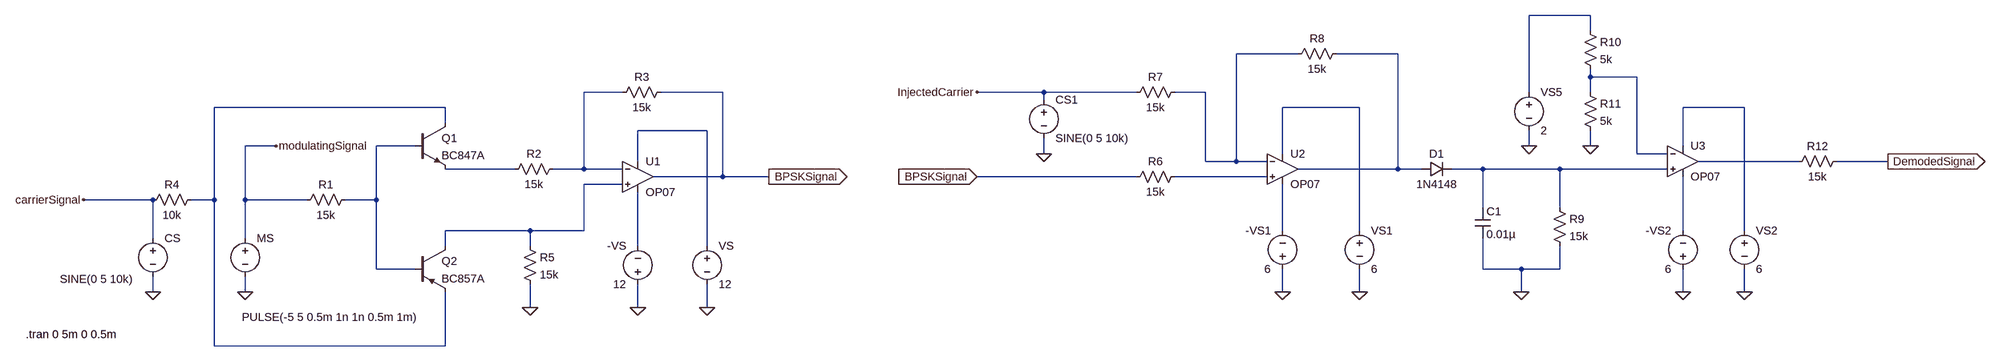
[diagram p0: schematic modulador_demoduladorBPSK_final.asc]
modulador_demoduladorBPSK_final.asc, the LTspice schematic file:
Version 4.1
SHEET 1 3504 680
WIRE 2624 -352 2496 -352
WIRE 2624 -320 2624 -352
WIRE 2016 -272 1888 -272
WIRE 2224 -272 2096 -272
WIRE 2624 -224 2624 -240
WIRE 2720 -224 2624 -224
WIRE 432 -192 352 -192
WIRE 640 -192 512 -192
WIRE 1488 -192 1344 -192
WIRE 1680 -192 1488 -192
WIRE 1824 -192 1760 -192
WIRE 2496 -192 2496 -352
WIRE 2624 -192 2624 -224
WIRE 1488 -176 1488 -192
WIRE 64 -160 -416 -160
WIRE 2144 -160 1984 -160
WIRE 2944 -160 2816 -160
WIRE 64 -128 64 -160
WIRE 608 -112 464 -112
WIRE -288 -80 -352 -80
WIRE 0 -80 -80 -80
WIRE 2496 -80 2496 -112
WIRE 2624 -80 2624 -112
WIRE 2816 -80 2816 -160
WIRE 1488 -64 1488 -96
WIRE 1984 -64 1984 -160
WIRE 2720 -64 2720 -224
WIRE 2784 -64 2720 -64
WIRE 464 -48 464 -112
WIRE 1824 -48 1824 -192
WIRE 1888 -48 1888 -272
WIRE 1888 -48 1824 -48
WIRE 1952 -48 1888 -48
WIRE 3056 -48 2848 -48
WIRE 3264 -48 3136 -48
WIRE 208 -32 64 -32
WIRE 352 -32 352 -192
WIRE 352 -32 288 -32
WIRE 432 -32 352 -32
WIRE 2224 -32 2224 -272
WIRE 2224 -32 2016 -32
WIRE 2272 -32 2224 -32
WIRE 2400 -32 2336 -32
WIRE 2560 -32 2400 -32
WIRE 2784 -32 2560 -32
WIRE 640 -16 640 -192
WIRE 640 -16 496 -16
WIRE 736 -16 640 -16
WIRE 1680 -16 1344 -16
WIRE 1952 -16 1760 -16
WIRE 432 0 352 0
WIRE -544 32 -688 32
WIRE -416 32 -416 -160
WIRE -416 32 -464 32
WIRE -352 32 -352 -80
WIRE -224 32 -352 32
WIRE -80 32 -80 -80
WIRE -80 32 -144 32
WIRE 2400 48 2400 -32
WIRE 2560 48 2560 -32
WIRE 240 96 64 96
WIRE 352 96 352 0
WIRE 352 96 240 96
WIRE 1984 96 1984 0
WIRE 2144 96 2144 -160
WIRE 2816 96 2816 -16
WIRE 2944 96 2944 -160
WIRE -544 112 -544 32
WIRE -352 112 -352 32
WIRE 64 128 64 96
WIRE 240 128 240 96
WIRE 464 128 464 16
WIRE 608 128 608 -112
WIRE -80 176 -80 32
WIRE 0 176 -80 176
WIRE 2400 176 2400 112
WIRE 2480 176 2400 176
WIRE 2560 176 2560 128
WIRE 2560 176 2480 176
WIRE -544 224 -544 192
WIRE -352 224 -352 192
WIRE 1984 224 1984 176
WIRE 2144 224 2144 176
WIRE 2480 224 2480 176
WIRE 2816 224 2816 176
WIRE 2944 224 2944 176
WIRE 240 256 240 208
WIRE 464 256 464 208
WIRE 608 256 608 208
WIRE -416 336 -416 32
WIRE 64 336 64 224
WIRE 64 336 -416 336
FLAG -352 224 0
FLAG 240 256 0
FLAG 464 256 0
FLAG 608 256 0
FLAG 736 -16 BPSKSignal
IOPIN 736 -16 Out
FLAG -544 224 0
FLAG -288 -80 modulatingSignal
FLAG -688 32 carrierSignal
FLAG 1344 -16 BPSKSignal
IOPIN 1344 -16 In
FLAG 1488 -64 0
FLAG 1984 224 0
FLAG 2144 224 0
FLAG 2480 224 0
FLAG 2496 -80 0
FLAG 2624 -80 0
FLAG 2816 224 0
FLAG 2944 224 0
FLAG 3264 -48 DemodedSignal
IOPIN 3264 -48 Out
FLAG 1344 -192 InjectedCarrier
SYMBOL voltage -352 96 R0
WINDOW 3 -7 180 Left 2
WINDOW 123 0 0 Left 0
WINDOW 39 0 0 Left 0
SYMATTR Value PULSE(-5 5 0.5m 1n 1n 0.5m 1m)
SYMATTR InstName MS
SYMBOL voltage -544 96 R0
WINDOW 3 -193 101 Left 2
WINDOW 123 0 0 Left 0
WINDOW 39 0 0 Left 0
SYMATTR Value SINE(0 5 10k)
SYMATTR InstName CS
SYMBOL voltage 608 112 R0
WINDOW 123 0 0 Left 0
WINDOW 39 0 0 Left 0
SYMATTR InstName VS
SYMATTR Value 12
SYMBOL res -128 16 R90
WINDOW 0 0 56 VBottom 2
WINDOW 3 32 56 VTop 2
SYMATTR InstName R1
SYMATTR Value 15k
SYMBOL res 304 -48 R90
WINDOW 0 0 56 VBottom 2
WINDOW 3 32 56 VTop 2
SYMATTR InstName R2
SYMATTR Value 15k
SYMBOL res 528 -208 R90
WINDOW 0 0 56 VBottom 2
WINDOW 3 32 56 VTop 2
SYMATTR InstName R3
SYMATTR Value 15k
SYMBOL res -560 48 R270
WINDOW 0 32 56 VTop 2
WINDOW 3 0 56 VBottom 2
SYMATTR InstName R4
SYMATTR Value 10k
SYMBOL res 224 112 R0
SYMATTR InstName R5
SYMATTR Value 15k
SYMBOL npn 0 -128 R0
SYMATTR InstName Q1
SYMATTR Value BC847A
SYMBOL pnp 0 128 R0
SYMATTR InstName Q2
SYMATTR Value BC857A
SYMBOL OpAmps\\OP07 464 -80 R0
SYMATTR InstName U1
SYMBOL voltage 464 224 R180
WINDOW 0 24 96 Left 2
WINDOW 3 24 16 Left 2
WINDOW 123 0 0 Left 0
WINDOW 39 0 0 Left 0
SYMATTR InstName -VS
SYMATTR Value 12
SYMBOL res 1776 -32 R90
WINDOW 0 0 56 VBottom 2
WINDOW 3 32 56 VTop 2
SYMATTR InstName R6
SYMATTR Value 15k
SYMBOL res 1776 -208 R90
WINDOW 0 0 56 VBottom 2
WINDOW 3 32 56 VTop 2
SYMATTR InstName R7
SYMATTR Value 15k
SYMBOL OpAmps\\OP07 1984 -96 R0
SYMATTR InstName U2
SYMBOL voltage 1488 -192 R0
WINDOW 123 0 0 Left 0
WINDOW 39 0 0 Left 0
SYMATTR InstName CS1
SYMATTR Value SINE(0 5 10k)
SYMBOL voltage 1984 192 R180
WINDOW 0 24 96 Left 2
WINDOW 3 24 16 Left 2
WINDOW 123 0 0 Left 0
WINDOW 39 0 0 Left 0
SYMATTR InstName -VS1
SYMATTR Value 6
SYMBOL voltage 2144 80 R0
WINDOW 123 0 0 Left 0
WINDOW 39 0 0 Left 0
SYMATTR InstName VS1
SYMATTR Value 6
SYMBOL res 2112 -288 R90
WINDOW 0 0 56 VBottom 2
WINDOW 3 32 56 VTop 2
SYMATTR InstName R8
SYMATTR Value 15k
SYMBOL diode 2272 -16 R270
WINDOW 0 32 32 VTop 2
WINDOW 3 0 32 VBottom 2
SYMATTR InstName D1
SYMATTR Value 1N4148
SYMBOL cap 2384 48 R0
SYMATTR InstName C1
SYMATTR Value 0.01µ
SYMBOL res 2544 32 R0
SYMATTR InstName R9
SYMATTR Value 15k
SYMBOL voltage 2496 -208 R0
SYMATTR InstName VS5
SYMATTR Value 2
SYMBOL res 2608 -336 R0
SYMATTR InstName R10
SYMATTR Value 5k
SYMBOL res 2608 -208 R0
SYMATTR InstName R11
SYMATTR Value 5k
SYMBOL OpAmps\\OP07 2816 -112 R0
SYMATTR InstName U3
SYMBOL voltage 2816 192 R180
WINDOW 0 24 96 Left 2
WINDOW 3 24 16 Left 2
WINDOW 123 0 0 Left 0
WINDOW 39 0 0 Left 0
SYMATTR InstName -VS2
SYMATTR Value 6
SYMBOL voltage 2944 80 R0
WINDOW 123 0 0 Left 0
WINDOW 39 0 0 Left 0
SYMATTR InstName VS2
SYMATTR Value 6
SYMBOL res 3152 -64 R90
WINDOW 0 0 56 VBottom 2
WINDOW 3 32 56 VTop 2
SYMATTR InstName R12
SYMATTR Value 15k
TEXT -808 312 Left 2 !.tran 0 5m 0 0.5m

The netlist it stands for:
* modulador_demoduladorBPSK_final.asc
V§MS modulatingSignal 0 PULSE(-5 5 0.5m 1n 1n 0.5m 1m)
V§CS carrierSignal 0 SINE(0 5 10k)
VS N009 0 12
R1 N010 modulatingSignal 15k
R2 N005 N012 15k
R3 BPSKSignal N005 15k
R4 carrierSignal N006 10k
R5 N015 0 15k
Q1 N006 N010 N012 0 BC847A
Q2 N015 N010 N006 0 BC857A
X§U1 N015 N005 N009 N018 BPSKSignal LT1001  ; OP07, pins In+ In- V+ V- OUT
V§-VS 0 N018 12
R6 N014 BPSKSignal 15k
R7 N002 InjectedCarrier 15k
X§U2 N014 N002 N007 N016 N003 LT1001  ; OP07, pins In+ In- V+ V- OUT
V§CS1 InjectedCarrier 0 SINE(0 5 10k)
V§-VS1 0 N016 6
VS1 N007 0 6
R8 N003 N002 15k
D1 N003 N013 1N4148
C1 N013 0 0.01µ
R9 N013 0 15k
VS5 N001 0 2
R10 N001 N004 5k
R11 N004 0 5k
X§U3 N013 N004 N008 N017 N011 LT1001  ; OP07, pins In+ In- V+ V- OUT
V§-VS2 0 N017 6
VS2 N008 0 6
R12 DemodedSignal N011 15k
.model D D
.lib standard.dio
.model NPN NPN
.model PNP PNP
.lib standard.bjt
.tran 0 5m 0 0.5m
.lib LTC.lib
.backanno
.end